# EAGLE schematic Papra TH (EAGLE 9.6.2)
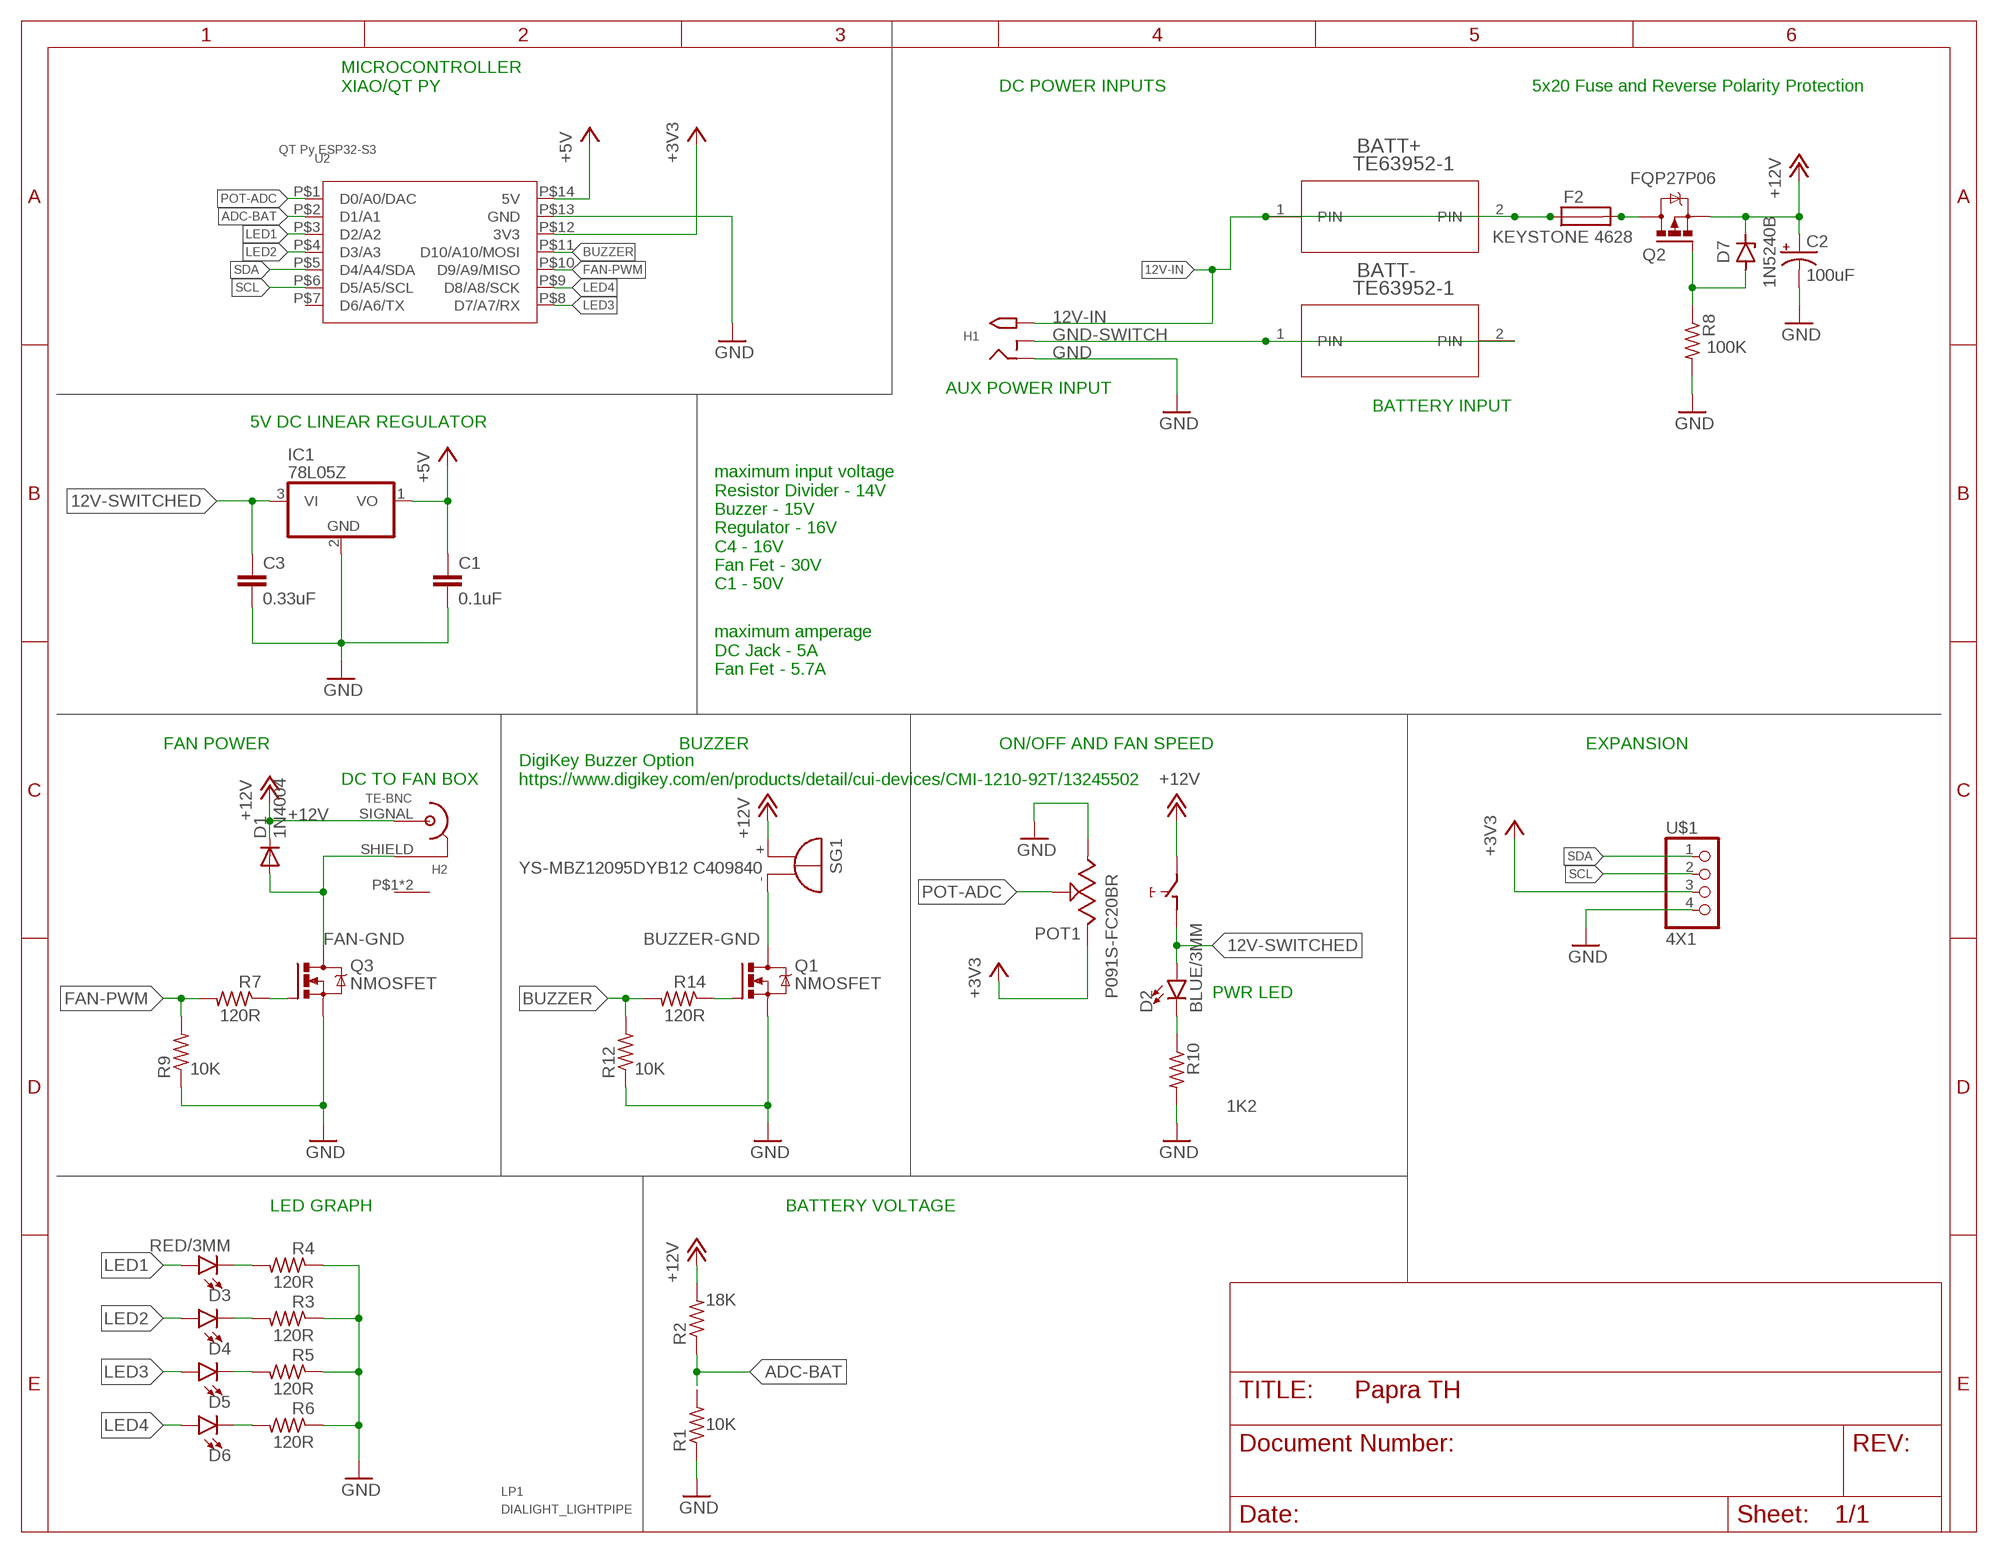
[diagram p0: schematic, sheet 1]

## Parts
BATT+  TE63952-1  [TE63952-1]
BATT-  TE63952-1  [TE63952-1]
C1  0.1uF  0.1UF-KIT-EZ-50V-20%  [CAP-PTH-SMALL-KIT]
C2  100uF  100UF-POLAR-RADIAL-2.5MM-25V-20%  [CPOL-RADIAL-2.5MM-6.5MM]
C3  0.33uF  0.1UF-KIT-EZ-50V-20%  [CAP-PTH-SMALL-KIT]
D1  1N4004  [DO41-10]
D2  BLUE/3MM  LED3MM  [LED_3MM]
D3  RED/3MM  LED3MM  [LED_3MM]
D4  RED/3MM  LED3MM  [LED_3MM]
D5  RED/3MM  LED3MM  [LED_3MM]
D6  RED/3MM  LED3MM  [LED_3MM]
D7  1N5240B  ZENER_DIODE-AXIAL  [DIODE-AXIAL]
F2  KEYSTONE 4628  FH_5X20  [FH_5X20]
H1  M-CUI-PJ-066A  PJ-066A  [DCJACK-PJ-066A]
H2  TE-BNC  [TE-BNC]
IC1  78L05Z  [TO92]
LP1  DIALIGHT_LIGHTPIPE  [DIALIGHT_5151020F_/LEDS]
POT1  P091S-FC20BR  [P091S-FC20BR]
Q1  NMOSFET  NMOSFET_TO220  [TO220BV]
Q2  FQP27P06  PMOSFET__TO220  [TO220BV]
Q3  NMOSFET  NMOSFET_TO220  [TO220BV]
R1  10K  R-US_0207/12  [0207/12]
R2  18K  R-US_0207/12  [0207/12]
R3  120R  R-US_0207/12  [0207/12]
R4  120R  R-US_0207/12  [0207/12]
R5  120R  R-US_0207/12  [0207/12]
R6  120R  R-US_0207/12  [0207/12]
R7  120R  R-US_0207/12  [0207/12]
R8  100K  R-US_0207/12  [0207/12]
R9  10K  R-US_0207/12  [0207/12]
R10  1K2  R-US_0207/12  [0207/12]
R12  10K  R-US_0207/12  [0207/12]
R14  120R  R-US_0207/12  [0207/12]
SG1  YS-MBZ12095DYB12 C409840  F/TMB  [F/TMB]
U2  QT Py ESP32-S3  MOUDLE-SEEEDUINO-XIAOTHRUHOLE+CASTELLATION  [MODULE14P-TH+PAD]
U$1  4X1  [01X4]

## Nets
12V-IN [RAIL]: BATT+.1(PIN) BATT+.2(PIN) F2.1A F2.1B H1.PWR(TIP)
12V-IN-FUSED: F2.2A F2.2B Q2.D
12V-IN-GATE: D7.1(A) Q2.G R8.1
12V-SWITCHED: C3.1 D2.A IC1.3(VI) POT1.COM
+3V3: POT1.3 U2.P$12(3V3) U$1.3
+5V [RAIL]: C1.1 IC1.1(VO) U2.P$14(5V)
+12V [RAIL]: C2.1(+) D1.C D7.2(C) H2.SIGNAL(P1) POT1.NO Q2.S R2.2 SG1.+
ADC-BAT: R1.2 R2.1 U2.P$2(D1/A1)
BUZZER: R12.2 R14.2 U2.P$11(D10/A10/MOSI)
BUZZER-GND [RAIL]: Q1.D SG1.-
FAN-GND [RAIL]: D1.A H2.SHIELD(P2) Q3.D
FAN-PWM: R7.2 R9.2 U2.P$10(D9/A9/MISO)
FETGATE: Q3.G R7.1
FETGATE1: Q1.G R14.1
GND: C1.2 C2.2(-) C3.2 H1.GND(RING) IC1.2(GND) POT1.1 Q1.S Q3.S R1.1 R3.1 R4.1 R5.1 R6.1 R8.2 R9.1 R10.2 R12.1 U2.P$13(GND) U$1.4
GND-SWITCH: BATT-.1(PIN) BATT-.2(PIN) H1.GNDBREAK(RING_SW)
LED1: D3.A U2.P$3(D2/A2)
LED2: D4.A U2.P$4(D3/A3)
LED3: D5.A U2.P$8(D7/A7/RX)
LED4: D6.A U2.P$9(D8/A8/SCK)
LED5-R: D2.K(C) R10.1
N$1: D4.K(C) R3.2
N$2: D3.K(C) R4.2
N$3: D5.K(C) R5.2
N$4: D6.K(C) R6.2
POT-ADC: POT1.2 U2.P$1(D0/A0/DAC)
SCL: U2.P$6(D5/A5/SCL) U$1.2
SDA: U2.P$5(D4/A4/SDA) U$1.1
Unconnected: H2.P$1(P3) H2.P$2(P3) U2.P$7(D6/A6/TX)

## Notes on the sheet
- MICROCONTROLLER
  XIAO/QT PY
- DC POWER INPUTS | 5x20 Fuse and Reverse Polarity Protection
- AUX POWER INPUT
- BATTERY INPUT
- 5V DC LINEAR REGULATOR
- maximum input voltage
  Resistor Divider - 14V
  Buzzer - 15V
  Regulator - 16V
  C4 - 16V
  Fan Fet - 30V
  C1 - 50V
- maximum amperage
  DC Jack - 5A
  Fan Fet - 5.7A
- FAN POWER | BUZZER | ON/OFF AND FAN SPEED | EXPANSION
- DC TO FAN BOX
- DigiKey Buzzer Option
  https://www.digikey.com/en/products/detail/cui-devices/CMI-1210-92T/13245502
- PWR LED
- LED GRAPH | BATTERY VOLTAGE

## Library data of the parts
BATT+ BATT- = PC-LIB:TE63952-1
C1 = SparkFun-Capacitors:0.1UF: 0.1µF ceramic capacitors A capacitor is a passive two-terminal electrical component used to store electrical energy temporarily in an electric field.; PROD_ID: CAP-08370
C2 = SparkFun-Capacitors:100UF-POLAR: 100µF polarized capacitors A capacitor is a passive two-terminal electrical component used to store electrical energy temporarily in an electric field.; PROD_ID: CAP-08439
C3 = SparkFun-Capacitors:0.1UF: 0.1µF ceramic capacitors A capacitor is a passive two-terminal electrical component used to store electrical energy temporarily in an electric field.; PROD_ID: CAP-08370; VALUE: 0.1uF
D1 = adafruit:1N4004: DIODE General purpose 1N400x type rectifier (With bigger pads) http://www.ladyada.net/library/pcb/eaglelibrary.html
D2-D6 = SparkFun-LED:LED: LED (Generic) Standard schematic elements and footprints for 5mm, 3mm, 1206, and 0603 sized LEDs. Generic LEDs with no color specified.; PROD_ID: DIO-08794
D7 = Tinkercad:ZENER: Zener Diode - Generic
F2 = keystone:FH_5X20: FUSE 5 x 20 mm
H1 = PC-LIB:PJ-066A
H2 = PC-LIB:TE-BNC: https://www.te.com/usa-en/product-1-1478032-0.html
IC1 = adafruit:78*: Positive VOLTAGE REGULATOR Added bigger pads to the TO-92 package
LP1 = PC-LIB:DIALIGHT_LIGHTPIPE: DIALIGHT QUAD LIGHTPIPE 515-1020 WITH 0805LEDS
POT1 = PC-LIB:P091S-FC20BR: TT P091S-FC20BR10K
Q1 Q3 = Transistor:NMOSFET: N-Channel MOSFET - Generic; CATEGORY: Transistor; SUB-CATEGORY: MOSFET; TYPE: N-Channel
Q2 = Tinkercad:PMOSFET: P-Channel MOSFET - Generic; CATEGORY: Transistor; SUB-CATEGORY: MOSFET; TYPE: P-Channel; VALUE: PMOSFET
R1-R10 R12 R14 = rcl:R-US_: RESISTOR, American symbol; SPICEPREFIX: R
SG1 = buzzer:F/TMB: BUZZER Source: Buerklin; OC_FARNELL: unknown; OC_NEWARK: unknown
U2 = Seeeduino-XIAO-footprint-eagle:MOUDLE-SEEEDUINO-XIAO
U$1 = PC-LIB:4X1

## Net classes
0 default: width 0.152 mm
1 RAIL: width 0.229 mm